# Altium schematic sheet Archimedes_Kontrolcu_Kati.SchDoc
size A4; SheetNumber: 8; SheetTotal: 8
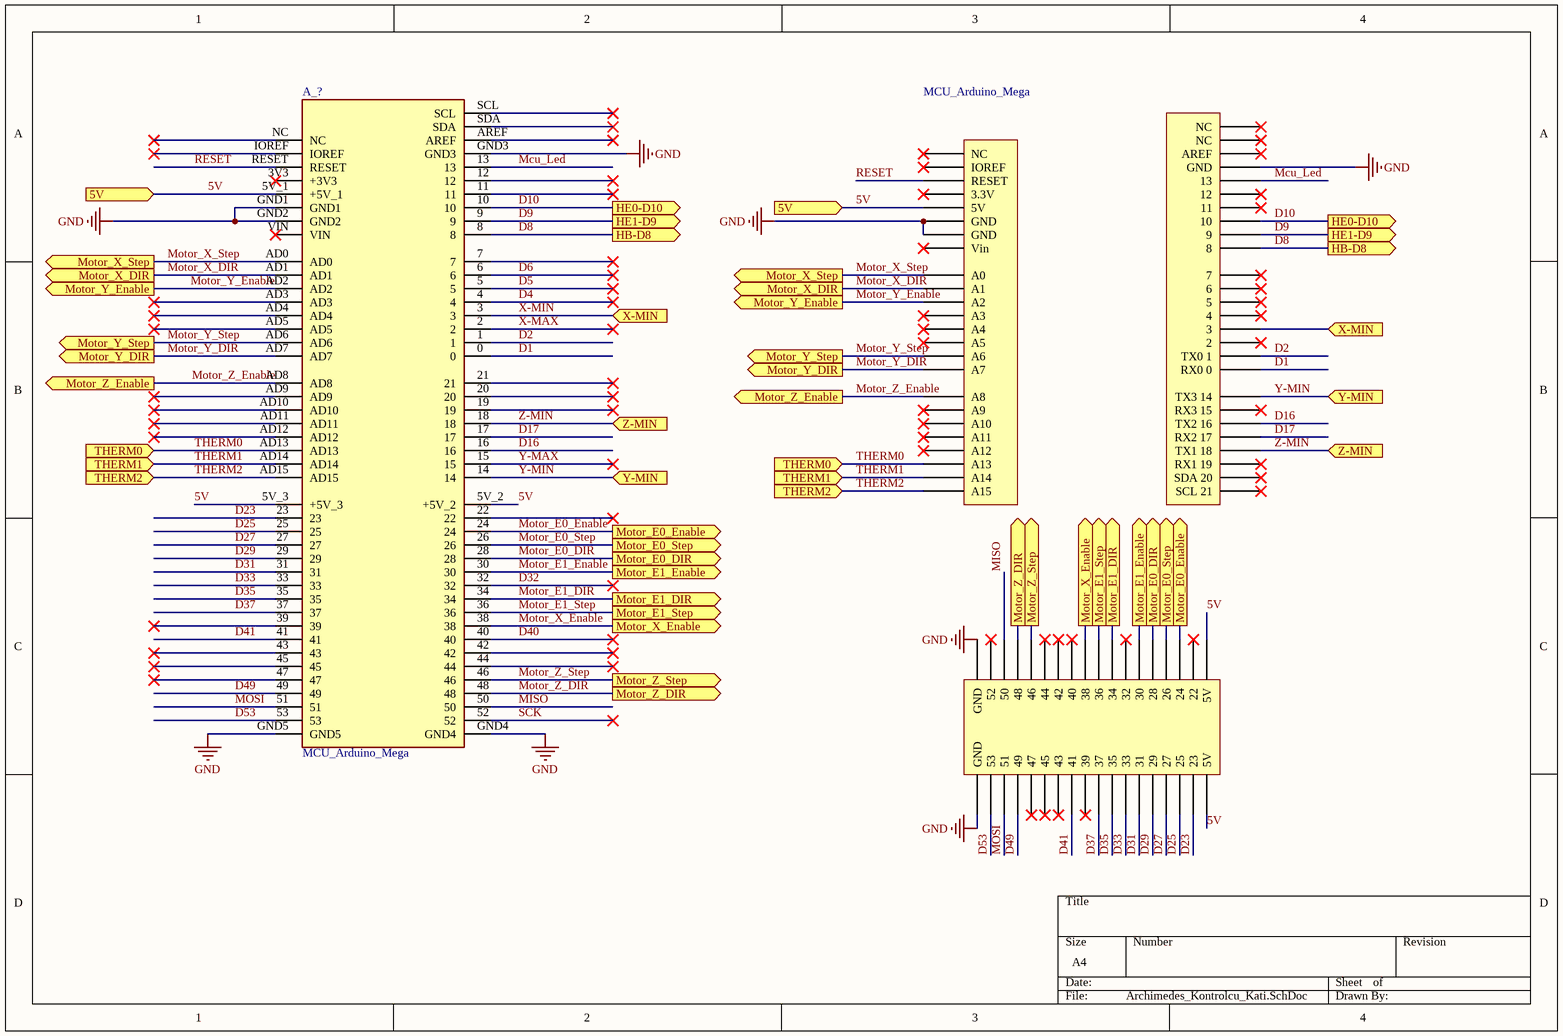
[diagram p0: Archimedes_Kontrolcu_Kati.SchDoc]

## Parts
A_?  MCU_Arduino_Mega  [Mcu_Arduino_mega]
MCU_Arduino_Mega  Arduino Mega 2560  [Arduino]  (value not drawn)

## Ports
5V (in), HB-D8 (out), HE0-D10 (out), HE1-D9 (out), Motor_E0_DIR (out), Motor_E0_Enable (out), Motor_E0_Step (out), Motor_E1_DIR (out), Motor_E1_Enable (out), Motor_E1_Step (out), Motor_X_DIR (out), Motor_X_Enable (out), Motor_X_Step (out), Motor_Y_DIR (out), Motor_Y_Enable (out), Motor_Y_Step (out), Motor_Z_DIR (out), Motor_Z_Enable (out), Motor_Z_Step (out), THERM0 (in), THERM1 (in), THERM2 (in), X-MIN (in), Y-MIN (in), Z-MIN (in)

## Nets
GND: A_?.GND1 A_?.GND2 A_?.GND3 A_?.GND4 A_?.GND5 MCU_Arduino_Mega.35(GND) MCU_Arduino_Mega.36(GND) MCU_Arduino_Mega.54(GND) MCU_Arduino_Mega.55(GND) MCU_Arduino_Mega.83(GND)
5V: A_?.5V_1(+5V_1) A_?.5V_2(+5V_2) A_?.5V_3(+5V_3) MCU_Arduino_Mega.1(5V) MCU_Arduino_Mega.2(5V) MCU_Arduino_Mega.56(5V) ; port 5V
D1: A_?.0 MCU_Arduino_Mega.69(RX0_0)
D2: A_?.1 MCU_Arduino_Mega.70(TX0_1)
D4: A_?.4
D5: A_?.5
D6: A_?.6
D8: A_?.8 MCU_Arduino_Mega.77(8) ; port HB-D8
D9: A_?.9 MCU_Arduino_Mega.78(9) ; port HE1-D9
D10: A_?.10 MCU_Arduino_Mega.79(10) ; port HE0-D10
D16: A_?.16 MCU_Arduino_Mega.66(TX2_16)
D17: A_?.17 MCU_Arduino_Mega.65(RX2_17)
D23: A_?.23 MCU_Arduino_Mega.4(23)
D25: A_?.25 MCU_Arduino_Mega.6(25)
D27: A_?.27 MCU_Arduino_Mega.8(27)
D29: A_?.29 MCU_Arduino_Mega.10(29)
D31: A_?.31 MCU_Arduino_Mega.12(31)
D32: A_?.32
D33: A_?.33 MCU_Arduino_Mega.14(33)
D35: A_?.35 MCU_Arduino_Mega.16(35)
D37: A_?.37 MCU_Arduino_Mega.18(37)
D40: A_?.40
D41: A_?.41 MCU_Arduino_Mega.22(41)
D49: A_?.49 MCU_Arduino_Mega.30(49)
D53: A_?.53 MCU_Arduino_Mega.34(53)
Mcu_Led: A_?.13 MCU_Arduino_Mega.82(13)
MISO: A_?.50 MCU_Arduino_Mega.31(50)
MOSI: A_?.51 MCU_Arduino_Mega.32(51)
Motor_E0_DIR: A_?.28 MCU_Arduino_Mega.9(28) ; port Motor_E0_DIR
Motor_E0_Enable: A_?.24 MCU_Arduino_Mega.5(24) ; port Motor_E0_Enable
Motor_E0_Step: A_?.26 MCU_Arduino_Mega.7(26) ; port Motor_E0_Step
Motor_E1_DIR: A_?.34 MCU_Arduino_Mega.15(34) ; port Motor_E1_DIR
Motor_E1_Enable: A_?.30 MCU_Arduino_Mega.11(30) ; port Motor_E1_Enable
Motor_E1_Step: A_?.36 MCU_Arduino_Mega.17(36) ; port Motor_E1_Step
Motor_X_DIR: A_?.AD1 MCU_Arduino_Mega.51(A1) ; port Motor_X_DIR
Motor_X_Enable: A_?.38 MCU_Arduino_Mega.19(38) ; port Motor_X_Enable
Motor_X_Step: A_?.AD0 MCU_Arduino_Mega.52(A0) ; port Motor_X_Step
Motor_Y_DIR: A_?.AD7 MCU_Arduino_Mega.45(A7) ; port Motor_Y_DIR
Motor_Y_Enable: A_?.AD2 MCU_Arduino_Mega.50(A2) ; port Motor_Y_Enable
Motor_Y_Step: A_?.AD6 MCU_Arduino_Mega.46(A6) ; port Motor_Y_Step
Motor_Z_DIR: A_?.48 MCU_Arduino_Mega.29(48) ; port Motor_Z_DIR
Motor_Z_Enable: A_?.AD8 MCU_Arduino_Mega.44(A8) ; port Motor_Z_Enable
Motor_Z_Step: A_?.46 MCU_Arduino_Mega.27(46) ; port Motor_Z_Step
RESET: A_?.RESET MCU_Arduino_Mega.58(RESET)
SCK: A_?.52
THERM0: A_?.AD13 MCU_Arduino_Mega.39(A13) ; port THERM0
THERM1: A_?.AD14 MCU_Arduino_Mega.38(A14) ; port THERM1
THERM2: A_?.AD15 MCU_Arduino_Mega.37(A15) ; port THERM2
X-MAX: A_?.2
X-MIN: A_?.3 MCU_Arduino_Mega.72(3) ; port X-MIN
Y-MAX: A_?.15
Y-MIN: A_?.14 MCU_Arduino_Mega.68(TX3_14) ; port Y-MIN
Z-MIN: A_?.18 MCU_Arduino_Mega.64(TX1_18) ; port Z-MIN

Not connected (* = marked no-connect by the designer): A_? 3V3(+3V3)* 7* 11* 12* 19* 20* 21* 22* 39* 42* 43* 44* 45* 47* AD3* AD4* AD5* AD9* AD10* AD11* AD12* AREF* IOREF* NC* SCL* SDA* VIN*; MCU_Arduino_Mega 3(22)* 13(32)* 20(39)* 21(40)* 23(42)* 24(43)* 25(44)* 26(45)* 28(47)* 33(52)* 40(A12)* 41(A11)* 42(A10)* 43(A9)* 47(A5)* 48(A4)* 49(A3)* 53(Vin)* 57(3.3V)* 59(IOREF)* 60(NC)* 61(SCL_21)* 62(SDA_20)* 63(RX1_19)* 67(RX3_15)* 71(2)* 73(4)* 74(5)* 75(6)* 76(7)* 80(11)* 81(12)* 84(AREF)* 85(NC)* 86(NC)*

## Library data of the parts
A_? = MCU_Arduino_Mega: Arduino mega rev 3; MP: A000067; Package: None; Value: *; Price: None; Availability: Unavailable